# Altium schematic sheet [04] - CPU POWER.SchDoc
size A4; DocumentNumber: 4; SheetNumber: 4; SheetTotal: 9
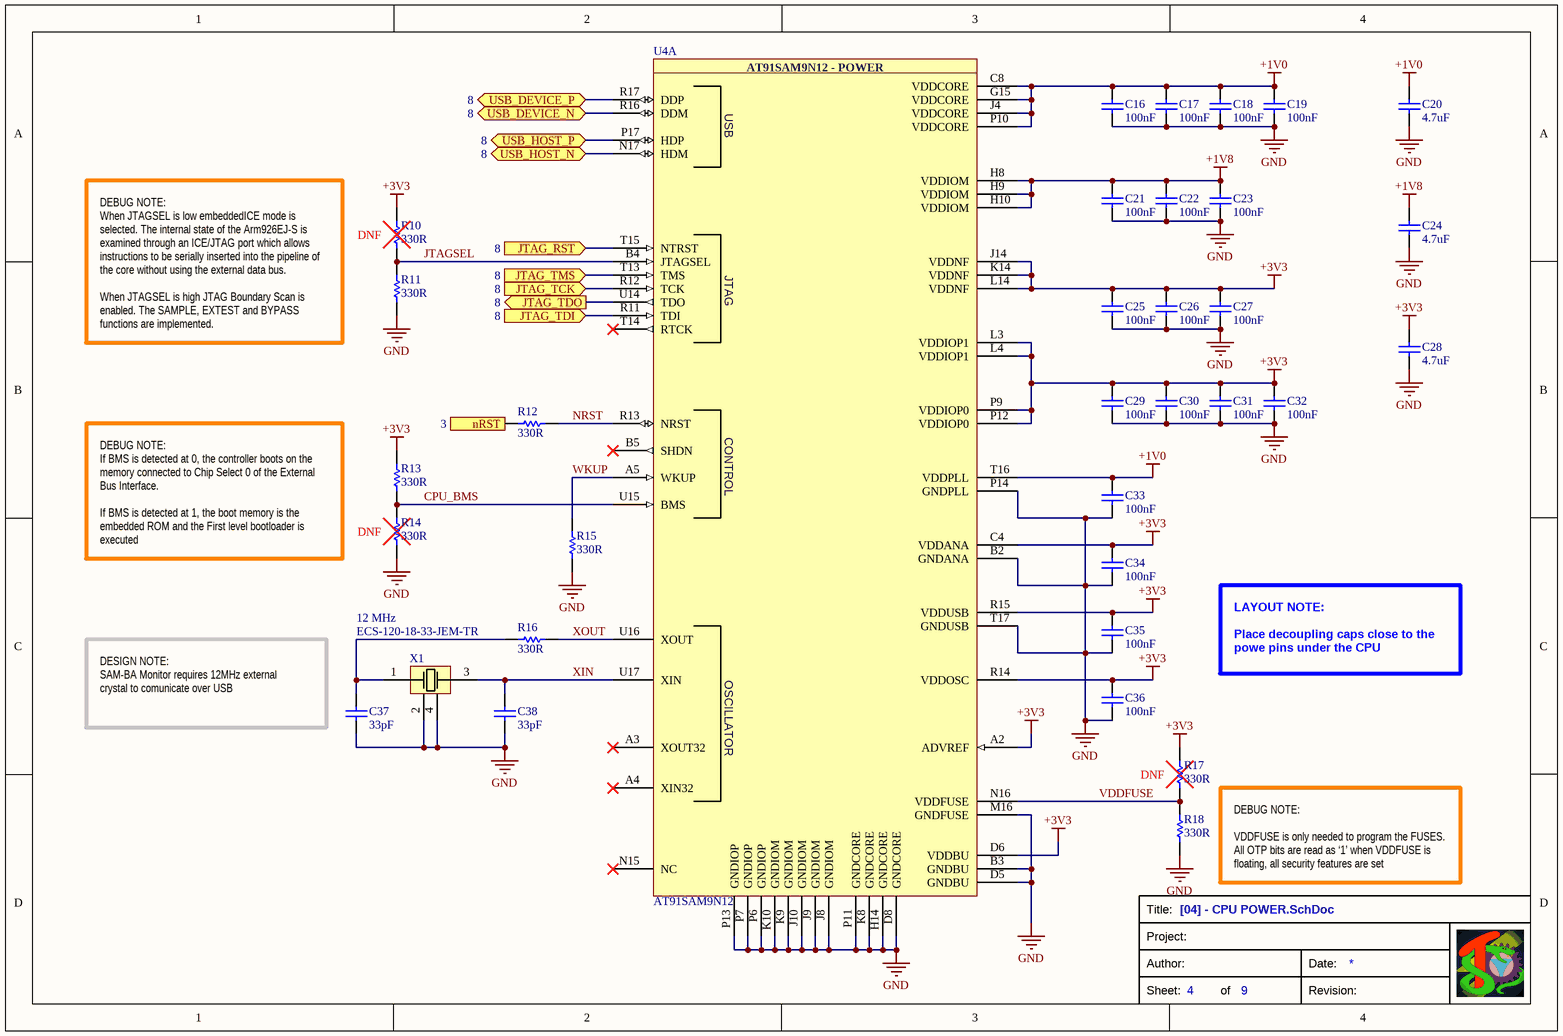
[diagram p0: [04] - CPU POWER.SchDoc]

## Parts
C16  value 100nF  [CAP-0603]  (hidden comment: C0603C104M4RAC)
C17  value 100nF  [CAP-0603]  (hidden comment: C0603C104M4RAC)
C18  value 100nF  [CAP-0603]  (hidden comment: C0603C104M4RAC)
C19  value 100nF  [CAP-0603]  (hidden comment: C0603C104M4RAC)
C20  value 4.7uF  [CAP-0805]  (hidden comment: 885012107013)
C21  value 100nF  [CAP-0603]  (hidden comment: C0603C104M4RAC)
C22  value 100nF  [CAP-0603]  (hidden comment: C0603C104M4RAC)
C23  value 100nF  [CAP-0603]  (hidden comment: C0603C104M4RAC)
C24  value 4.7uF  [CAP-0805]  (hidden comment: 885012107013)
C25  value 100nF  [CAP-0603]  (hidden comment: C0603C104M4RAC)
C26  value 100nF  [CAP-0603]  (hidden comment: C0603C104M4RAC)
C27  value 100nF  [CAP-0603]  (hidden comment: C0603C104M4RAC)
C28  value 4.7uF  [CAP-0805]  (hidden comment: 885012107013)
C29  value 100nF  [CAP-0603]  (hidden comment: C0603C104M4RAC)
C30  value 100nF  [CAP-0603]  (hidden comment: C0603C104M4RAC)
C31  value 100nF  [CAP-0603]  (hidden comment: C0603C104M4RAC)
C32  value 100nF  [CAP-0603]  (hidden comment: C0603C104M4RAC)
C33  value 100nF  [CAP-0603]  (hidden comment: C0603C104M4RAC)
C34  value 100nF  [CAP-0603]  (hidden comment: C0603C104M4RAC)
C35  value 100nF  [CAP-0603]  (hidden comment: C0603C104M4RAC)
C36  value 100nF  [CAP-0603]  (hidden comment: C0603C104M4RAC)
C37  value 33pF  [CAP-0603]  (hidden comment: 885012006054)
C38  value 33pF  [CAP-0603]  (hidden comment: 885012006054)
R10  value 330R  [RES-0603]  (hidden comment: RT0603FRD07330RL)
R11  value 330R  [RES-0603]  (hidden comment: RT0603FRD07330RL)
R12  value 330R  [RES-0603]  (hidden comment: RT0603FRD07330RL)
R13  value 330R  [RES-0603]  (hidden comment: RT0603FRD07330RL)
R14  value 330R  [RES-0603]  (hidden comment: RT0603FRD07330RL)
R15  value 330R  [RES-0603]  (hidden comment: RT0603FRD07330RL)
R16  value 330R  [RES-0603]  (hidden comment: RT0603FRD07330RL)
R17  value 330R  [RES-0603]  (hidden comment: RT0603FRD07330RL)
R18  value 330R  [RES-0603]  (hidden comment: RT0603FRD07330RL)
U4  AT91SAM9N12  [BGA0.8P17X17_217_15X15]  (part A of 6)
X1  ECS-120-18-33-JEM-TR  value 12 MHz  [XTAL-ECX32-3.2X2.5]

## Ports
JTAG_RST (in, see 8), JTAG_TCK (in, see 8), JTAG_TDI (in, see 8), JTAG_TDO (out, see 8), JTAG_TMS (in, see 8), nRST (in, see 3), USB_DEVICE_N (bidir, see 8), USB_DEVICE_P (bidir, see 8), USB_HOST_N (bidir, see 8), USB_HOST_P (bidir, see 8)

## Nets
+1V0: C16.2 C17.2 C18.2 C19.2 C20.2 C33.2 U4.C8(VDDCORE) U4.G15(VDDCORE) U4.J4(VDDCORE) U4.P10(VDDCORE) U4.T16(VDDPLL)
+1V8: C21.2 C22.2 C23.2 C24.2 U4.H8(VDDIOM) U4.H9(VDDIOM) U4.H10(VDDIOM)
+3V3: C25.2 C26.2 C27.2 C28.2 C29.2 C30.2 C31.2 C32.2 C34.2 C35.2 C36.2 R10.2 R13.2 R17.2 U4.A2(ADVREF) U4.C4(VDDANA) U4.D6(VDDBU) U4.J14(VDDNF) U4.K14(VDDNF) U4.L3(VDDIOP1) U4.L4(VDDIOP1) U4.L14(VDDNF) U4.P9(VDDIOP0) U4.P12(VDDIOP0) U4.R14(VDDOSC) U4.R15(VDDUSB)
GND: C16.1 C17.1 C18.1 C19.1 C20.1 C21.1 C22.1 C23.1 C24.1 C25.1 C26.1 C27.1 C28.1 C29.1 C30.1 C31.1 C32.1 C33.1 C34.1 C35.1 C36.1 C37.1 C38.1 R11.1 R14.1 R15.1 R18.1 U4.B2(GNDANA) U4.B3(GNDBU) U4.D5(GNDBU) U4.D8(GNDCORE) U4.H14(GNDCORE) U4.J8(GNDIOM) U4.J9(GNDIOM) U4.J10(GNDIOM) U4.K8(GNDCORE) U4.K9(GNDIOM) U4.K10(GNDIOM) U4.M16(GNDFUSE) U4.P6(GNDIOP) U4.P7(GNDIOP) U4.P11(GNDCORE) U4.P13(GNDIOP) U4.P14(GNDPLL) U4.T17(GNDUSB) X1.2 X1.4
CPU_BMS: R13.1 R14.2 U4.U15(BMS)
JTAG_RST: U4.T15(NTRST) ; port JTAG_RST
JTAG_TCK: U4.R12(TCK) ; port JTAG_TCK
JTAG_TDI: U4.R11(TDI) ; port JTAG_TDI
JTAG_TDO: U4.U14(TDO) ; port JTAG_TDO
JTAG_TMS: U4.T13(TMS) ; port JTAG_TMS
JTAGSEL: R10.1 R11.2 U4.B4(JTAGSEL)
NRST: R12.2 U4.R13(NRST)
nRST: R12.1 ; port nRST  [a separate net that carries the same name]
USB_DEVICE_N: U4.R16(DDM) ; port USB_DEVICE_N
USB_DEVICE_P: U4.R17(DDP) ; port USB_DEVICE_P
USB_HOST_N: U4.N17(HDM) ; port USB_HOST_N
USB_HOST_P: U4.P17(HDP) ; port USB_HOST_P
VDDFUSE: R17.1 R18.2 U4.N16(VDDFUSE)
WKUP: R15.2 U4.A5(WKUP)
XIN: C38.2 U4.U17(XIN) X1.3
XOUT: R16.2 U4.U16(XOUT)
NetC37_2: C37.2 R16.1 X1.1

Not connected (* = marked no-connect by the designer): U4 A3(XOUT32)* A4(XIN32)* B5(SHDN)* N15(NC)* T14(RTCK)*

## Notes on the sheet
- (near R10) DNF
- DEBUG NOTE:
  When JTAGSEL is low embeddedICE mode is selected. The internal state of the Arm926EJ-S is examined through an ICE/JTAG port which allows instructions to be serially inserted into the pipeline of the core without using the external data bus.
  When JTAGSEL is high JTAG Boundary Scan is enabled. The SAMPLE, EXTEST and BYPASS functions are implemented.
- DEBUG NOTE:
  If BMS is detected at 0, the controller boots on the memory connected to Chip Select 0 of the External Bus Interface.
  If BMS is detected at 1, the boot memory is the embedded ROM and the First level bootloader is executed
- (near R14) DNF
- DESIGN NOTE:
  SAM-BA Monitor requires 12MHz external crystal to comunicate over USB
- LAYOUT NOTE:
  Place decoupling caps close to the powe pins under the CPU
- (near R17) DNF
- DEBUG NOTE:
  VDDFUSE is only needed to program the FUSES. All OTP bits are read as ‘1’ when VDDFUSE is floating, all security features are set
- Title:
- Project:
- Sheet:
- Author:
- of
- Revision:
- Date:
- (in symbol AT91SAM9N12, part A) AT91SAM9N12 - POWER; USB; JTAG; CONTROL; OSCILLATOR

## Library data of the parts
C16-C19 C21-C23 C25-C27 C29-C36 = CAP-0603-100n-C0603C104M4RAC: Multilayer Ceramic Capacitors MLCC - SMD/SMT 16V 0.1uF X7R 0603 20%; Manufacturer: KEMET; Voltage Rating DC: 16 VDC; Supplier 1: Mouser; Supplier Part Number 1: 80-C0603C104M4RAC
C20 C24 C28 = CAP-0805-4.7u-885012107013_2: Multilayer Ceramic Capacitors MLCC - SMD/SMT WCAP-CSGP 4.7uF 0805 20% 16V MLCC; Manufacturer: Wurth Elektronik; Voltage Rating DC: 16 VDC; Supplier 1: Mouser; Supplier Part Number 1: 710-885012107013
C37 C38 = CAP-0603-33p-885012006054: Multilayer Ceramic Capacitors MLCC - SMD/SMT WCAP-CSGP 33pF 0603 5% 50V MLCC; Manufacturer: Wurth Elektronik; Voltage Rating DC: 50 VDC; Supplier 1: Mouser; Supplier Part Number 1: 710-885012006054
R10-R18 = RES-0603-330R-RT0603FRD07330RL: Thin Film Resistors - SMD 1/10W 330 ohm 1% 50ppm; Manufacturer: Yageo; Supplier 1: Mouser; Supplier Part Number 1: 603-RT0603FRD07330RL
U4 = AT91SAM9N12: MPU ARM926EJ-S 400MHz; Supplier 1: Mouser; Supplier Part Number 1: 556-AT91SAM9N12-CU
X1 = XTAL-12MHz-ECS-120-18-33-JEM-TR: Crystals 12MHz 20ppm 18pF -20C +70C; Supplier 1: Mouser; Supplier Part Number 1: 520-120-18-33-JEMT; Shunt Capacitance: 18 pF